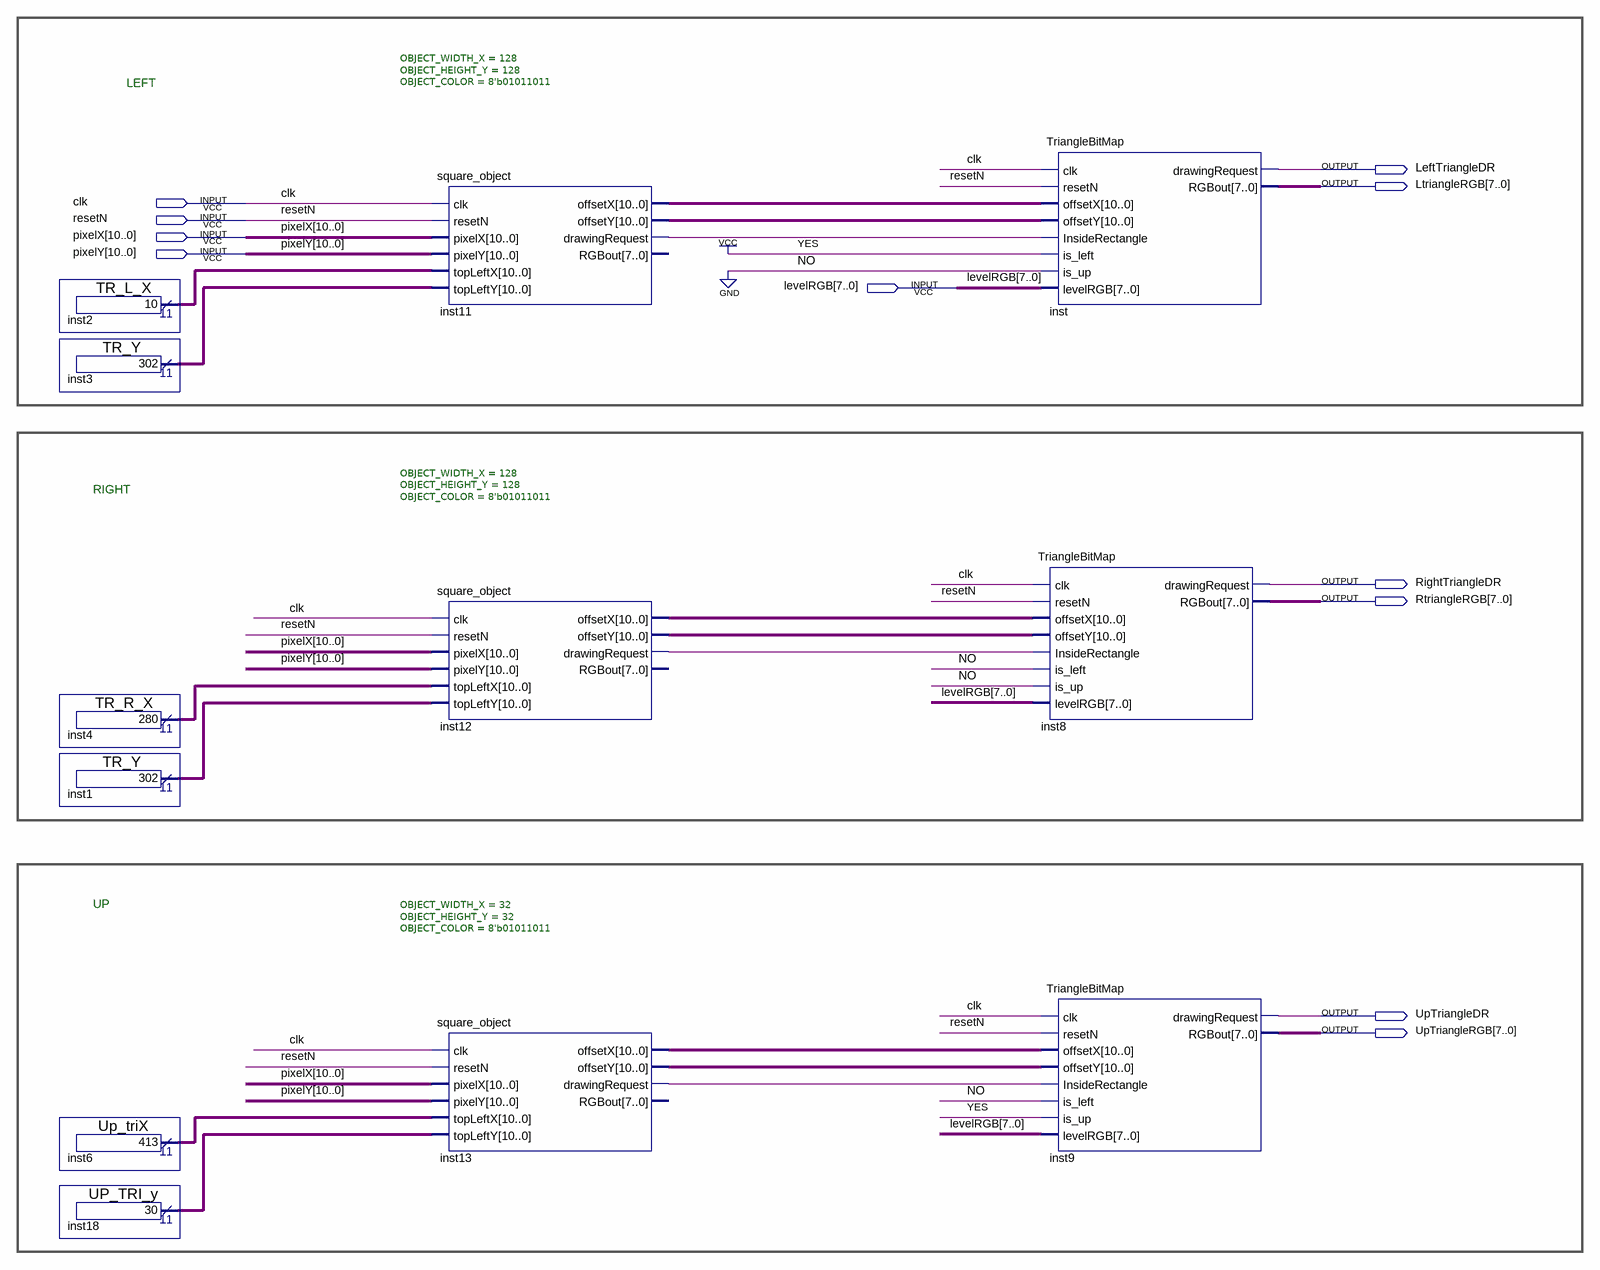
[diagram p0: schematic sheet]
// Quartus schematic TRIANGLE_DISPLAY.bdf as structural Verilog: 12 symbols, 11 pins
module TRIANGLE_DISPLAY (
  input  clk,
  input  resetN,
  input  [10:0] pixelX,
  input  [10:0] pixelY,
  input  [7:0] levelRGB,
  output LeftTriangleDR,
  output [7:0] LtriangleRGB,
  output RightTriangleDR,
  output [7:0] RtriangleRGB,
  output UpTriangleDR,
  output [7:0] UpTriangleRGB
);

  wire inst11_drawingrequest, inst12_drawingrequest, inst13_drawingrequest;
  wire [10:0] inst1_result, inst2_result, inst3_result, inst4_result, inst6_result, inst11_offsetx,
       inst11_offsety, inst12_offsetx, inst12_offsety, inst13_offsetx, inst13_offsety, inst18_result;

  TR_L_X inst2 (.result(inst2_result));
  TR_Y inst3 (.result(inst3_result));
  TR_R_X inst4 (.result(inst4_result));
  TR_Y inst1 (.result(inst1_result));
  Up_triX inst6 (.result(inst6_result));
  UP_TRI_y inst18 (.result(inst18_result));
  square_object #(.OBJECT_WIDTH_X(128), .OBJECT_HEIGHT_Y(128), .OBJECT_COLOR(8'b01011011)) inst11 (
    .clk(clk), .resetN(resetN), .pixelX(pixelX), .pixelY(pixelY), .topLeftX(inst2_result),
    .topLeftY(inst3_result), .offsetX(inst11_offsetx), .offsetY(inst11_offsety),
    .drawingRequest(inst11_drawingrequest));  // open: RGBout
  square_object #(.OBJECT_WIDTH_X(128), .OBJECT_HEIGHT_Y(128), .OBJECT_COLOR(8'b01011011)) inst12 (
    .clk(clk), .resetN(resetN), .pixelX(pixelX), .pixelY(pixelY), .topLeftX(inst4_result),
    .topLeftY(inst1_result), .offsetX(inst12_offsetx), .offsetY(inst12_offsety),
    .drawingRequest(inst12_drawingrequest));  // open: RGBout
  square_object #(.OBJECT_WIDTH_X(32), .OBJECT_HEIGHT_Y(32), .OBJECT_COLOR(8'b01011011)) inst13 (
    .clk(clk), .resetN(resetN), .pixelX(pixelX), .pixelY(pixelY), .topLeftX(inst6_result),
    .topLeftY(inst18_result), .offsetX(inst13_offsetx), .offsetY(inst13_offsety),
    .drawingRequest(inst13_drawingrequest));  // open: RGBout
  TriangleBitMap inst (
    .clk(clk), .resetN(resetN), .offsetX(inst11_offsetx), .offsetY(inst11_offsety),
    .InsideRectangle(inst11_drawingrequest), .is_left(1'b1), .is_up(1'b0), .levelRGB(levelRGB),
    .drawingRequest(LeftTriangleDR), .RGBout(LtriangleRGB));
  TriangleBitMap inst8 (
    .clk(clk), .resetN(resetN), .offsetX(inst12_offsetx), .offsetY(inst12_offsety),
    .InsideRectangle(inst12_drawingrequest), .is_left(1'b0), .is_up(1'b0), .levelRGB(levelRGB),
    .drawingRequest(RightTriangleDR), .RGBout(RtriangleRGB));
  TriangleBitMap inst9 (
    .clk(clk), .resetN(resetN), .offsetX(inst13_offsetx), .offsetY(inst13_offsety),
    .InsideRectangle(inst13_drawingrequest), .is_left(1'b0), .is_up(1'b1), .levelRGB(levelRGB),
    .drawingRequest(UpTriangleDR), .RGBout(UpTriangleRGB));

  // Notes on the sheet:
  //   LEFT
  //   RIGHT
  //   UP
endmodule
